# Altium schematic sheet MCU.SchDoc: Microcontroller
size B; CheckedBy: Lance Bantoto; Engineer: Cindy Li; Organization: Altium Limited; Address1: L3, 12a Rodborough Rd; Address2: Frenchs Forest; Address3: NSW; Address4: Australia 2086; Revision: 1; SheetNumber: 3; SheetTotal: 6
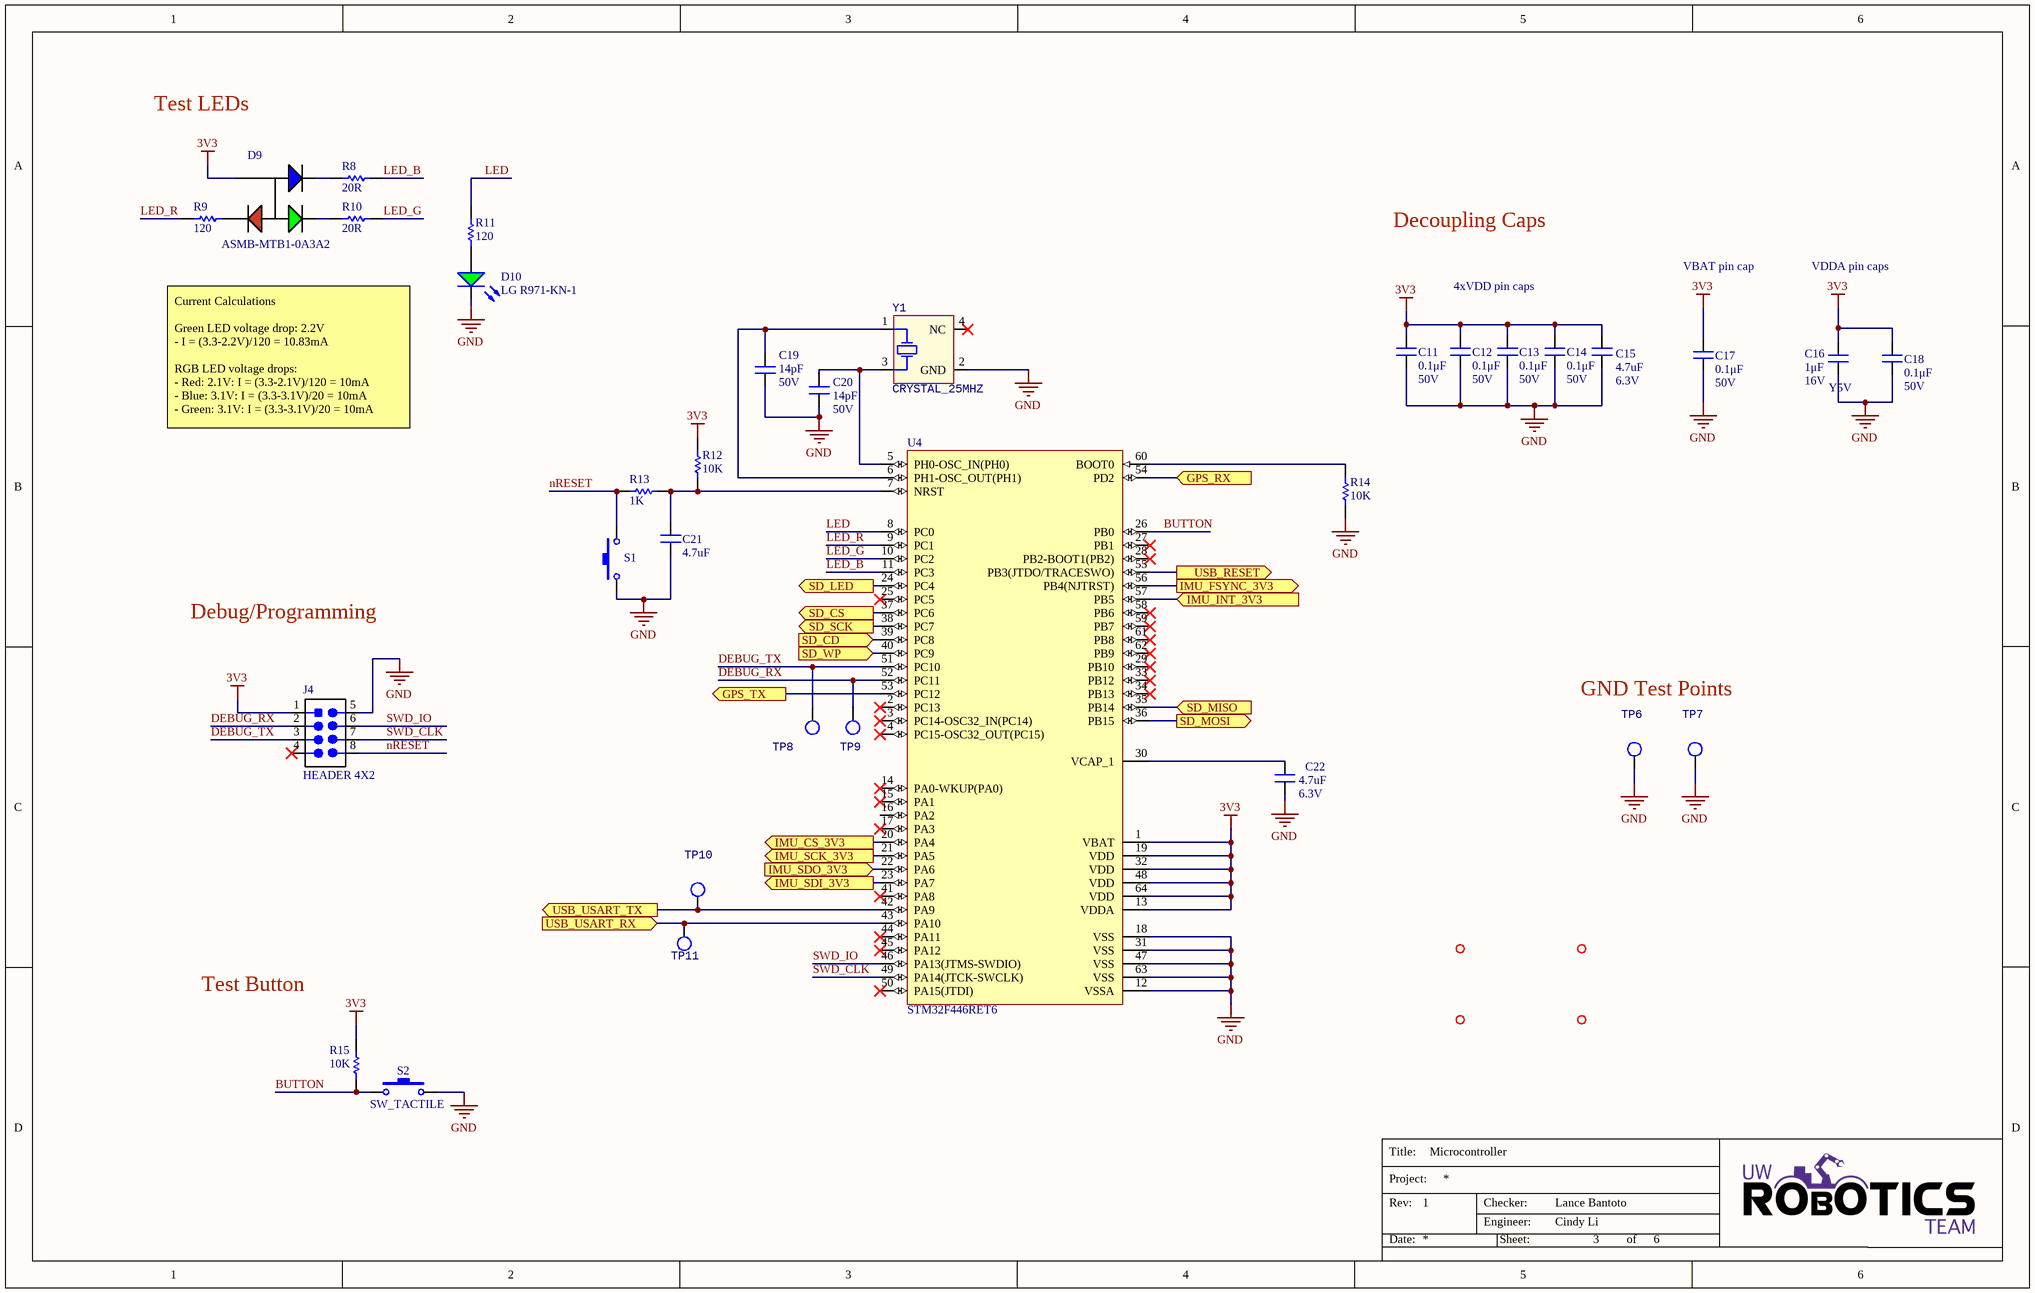
[diagram p0: MCU.SchDoc]

## Parts
C11  value 0.1μF  Voltage Rating: 50V  [CAP2012]  (hidden comment: CAP_0.1uF_50V_0805)
C12  value 0.1μF  Voltage Rating: 50V  [CAP2012]  (hidden comment: CAP_0.1uF_50V_0805)
C13  value 0.1μF  Voltage Rating: 50V  [CAP2012]  (hidden comment: CAP_0.1uF_50V_0805)
C14  value 0.1μF  Voltage Rating: 50V  [CAP2012]  (hidden comment: CAP_0.1uF_50V_0805)
C15  value 4.7uF  Voltage Rating: 6.3V  [CAPC0603(1608)55_N]  (hidden comment: CAP_4.7uF_0603)
C16  value 1μF  Voltage Rating: 16V  Dielectric: Y5V  [CAP0603]  (hidden comment: CAP_1uF_16V_0603)
C17  value 0.1μF  Voltage Rating: 50V  [CAP2012]  (hidden comment: CAP_0.1uF_50V_0805)
C18  value 0.1μF  Voltage Rating: 50V  [CAP2012]  (hidden comment: CAP_0.1uF_50V_0805)
C19  value 14pF  Voltage Rating (DC): 50V  [CAPC0603(1608)55_N]  (hidden comment: CL10C140JB8NNNC)
C20  value 14pF  Voltage Rating (DC): 50V  [CAPC0603(1608)55_N]  (hidden comment: CL10C140JB8NNNC)
C21  value 4.7uF  [CAPC0603(1608)55_N]  (hidden comment: CAP_4.7uF_0603)
C22  value 4.7uF  Voltage Rating: 6.3V  [CAPC0603(1608)55_N]  (hidden comment: CAP_4.7uF_0603)
D9  Manufacturer Part Number 1: ASMB-MTB1-0A3A2  [LED_RGB]  (hidden comment: LED_RGB)
D10  LG R971-KN-1  [LED_0805_GREEN]
J4  HEADER 4X2  [HEADER_2X4]
MH1  MOUNTING_HOLES  [MOUNTING_HOLE]  (value not drawn)
MH2  MOUNTING_HOLES  [MOUNTING_HOLE]  (value not drawn)
MH3  MOUNTING_HOLES  [MOUNTING_HOLE]  (value not drawn)
MH4  MOUNTING_HOLES  [MOUNTING_HOLE]  (value not drawn)
R8  value 20R  [RESC0603(1608)_N]  (hidden comment: RES_20R_0603)
R9  value 120  [RESC0603(1608)_N]  (hidden comment: RES_120R_0603)
R10  value 20R  [RESC0603(1608)_N]  (hidden comment: RES_20R_0603)
R11  value 120  [RESC0603(1608)_N]  (hidden comment: RES_120R_0603)
R12  value 10K  [RESC0603(1608)_N]  (hidden comment: RES_10K_0603)
R13  value 1K  [RESC0603(1608)_N]  (hidden comment: RES_1K_0603)
R14  value 10K  [RESC0603(1608)_N]  (hidden comment: RES_10K_0603)
R15  value 10K  [RESC0603(1608)_N]  (hidden comment: RES_10K_0603)
S1  SW_TACTILE  [B3U-1000P]  (value not drawn)
S2  SW_TACTILE  [B3U-1000P]
TP6  TESTPOINT_LOOP  [TESTPOINT_LOOP]  (value not drawn)
TP7  TESTPOINT_LOOP  [TESTPOINT_LOOP]  (value not drawn)
TP8  TESTPOINT_LOOP  [TESTPOINT_LOOP]  (value not drawn)
TP9  TESTPOINT_LOOP  [TESTPOINT_LOOP]  (value not drawn)
TP10  TESTPOINT_LOOP  [TESTPOINT_LOOP]  (value not drawn)
TP11  TESTPOINT_LOOP  [TESTPOINT_LOOP]  (value not drawn)
U4  STM32F446RET6  [STM-LQFP64_L]
Y1  CRYSTAL_25MHZ  [SOIC254P1016X440-4N]

## Ports
GPS_RX (in), GPS_TX (out), IMU_CS_3V3 (out), IMU_FSYNC_3V3 (out), IMU_INT_3V3 (in), IMU_SCK_3V3 (out), IMU_SDI_3V3 (out), IMU_SDO_3V3 (in), SD_CD (in), SD_CS (out), SD_LED (out), SD_MISO (in), SD_MOSI (out), SD_SCK (out), SD_WP (in), USB_RESET (out), USB_USART_RX (in), USB_USART_TX (out)

## Nets
3V3: C11.2 C12.2 C13.2 C14.2 C15.2 C16.2 C17.2 C18.2 D9.4(COMMON_ANODE) J4.1(VCC) R12.2 R15.1 U4.1(VBAT) U4.13(VDDA) U4.19(VDD) U4.32(VDD) U4.48(VDD) U4.64(VDD)
GND: C11.1 C12.1 C13.1 C14.1 C15.1 C16.1 C17.1 C18.1 C19.1 C20.1 C21.1 C22.1 D10.2(K) J4.5(GND) R14.2 S1.1 S2.2 TP6.1 TP7.1 U4.12(VSSA) U4.18(VSS) U4.31(VSS) U4.47(VSS) U4.63(VSS) Y1.2(GND)
BUTTON: R15.2 S2.1 U4.26(PB0)
DEBUG_RX: J4.2 TP9.1 U4.52(PC11)
DEBUG_TX: J4.3 TP8.1 U4.51(PC10)
GPS_RX: U4.54(PD2) ; port GPS_RX
GPS_TX: U4.53(PC12) ; port GPS_TX
IMU_CS_3V3: U4.20(PA4) ; port IMU_CS_3V3
IMU_FSYNC_3V3: U4.56(PB4(NJTRST)) ; port IMU_FSYNC_3V3
IMU_INT_3V3: U4.57(PB5) ; port IMU_INT_3V3
IMU_SCK_3V3: U4.21(PA5) ; port IMU_SCK_3V3
IMU_SDI_3V3: U4.23(PA7) ; port IMU_SDI_3V3
IMU_SDO_3V3: U4.22(PA6) ; port IMU_SDO_3V3
LED: R11.1 U4.8(PC0)
LED_B: R8.2 U4.11(PC3)
LED_G: R10.2 U4.10(PC2)
LED_R: R9.1 U4.9(PC1)
nRESET: J4.8 R13.1 S1.2
SD_CD: U4.39(PC8) ; port SD_CD
SD_CS: U4.37(PC6) ; port SD_CS
SD_LED: U4.24(PC4) ; port SD_LED
SD_MISO: U4.35(PB14) ; port SD_MISO
SD_MOSI: U4.36(PB15) ; port SD_MOSI
SD_SCK: U4.38(PC7) ; port SD_SCK
SD_WP: U4.40(PC9) ; port SD_WP
SWD_CLK: J4.7 U4.49(PA14(JTCK-SWCLK))
SWD_IO: J4.6 U4.46(PA13(JTMS-SWDIO))
USB_RESET: U4.55(PB3(JTDO/TRACESWO)) ; port USB_RESET
USB_USART_RX: TP11.1 U4.43(PA10) ; port USB_USART_RX
USB_USART_TX: TP10.1 U4.42(PA9) ; port USB_USART_TX
NetC19_2: C19.2 U4.6(PH1-OSC_OUT(PH1)) Y1.1(HOT)
NetC20_2: C20.2 U4.5(PH0-OSC_IN(PH0)) Y1.3(HOT)
NetC21_2: C21.2 R12.1 R13.2 U4.7(NRST)
NetC22_2: C22.2 U4.30(VCAP_1)
NetD9_1: D9.1(CATHODE_(RED)) R9.2
NetD9_2: D9.2(CATHODE_(GREEN)) R10.1
NetD9_3: D9.3(CATHODE_(BLUE)) R8.1
NetD10_1: D10.1(A) R11.2
NetR14_1: R14.1 U4.60(BOOT0)

Not connected (* = marked no-connect by the designer): J4 4*; U4 2(PC13)* 3(PC14-OSC32_IN(PC14))* 4(PC15-OSC32_OUT(PC15))* 14(PA0-WKUP(PA0))* 15(PA1)* 16(PA2) 17(PA3)* 25(PC5)* 27(PB1)* 28(PB2-BOOT1(PB2))* 29(PB10)* 33(PB12)* 34(PB13)* 41(PA8)* 44(PA11)* 45(PA12)* 50(PA15(JTDI))* 58(PB6)* 59(PB7)* 61(PB8)* 62(PB9)*; Y1 4(NC)*

## Notes on the sheet
- Test LEDs
- Decoupling Caps
- 4xVDD pin caps
- VBAT pin cap
- VDDA pin caps
- Current Calculations
  Green LED voltage drop: 2.2V
  - I = (3.3-2.2V)/120 = 10.83mA
  RGB LED voltage drops:
  - Red: 2.1V: I = (3.3-2.1V)/120 = 10mA
  - Blue: 3.1V: I = (3.3-3.1V)/20 = 10mA
  - Green: 3.1V: I = (3.3-3.1V)/20 = 10mA
- Debug/Programming
- GND Test Points
- Test Button
- Title:
- Project:
- Date:
- Rev:
- Checker:
- Engineer:
- Sheet:
- of

## Library data of the parts
C11-C14 C17 C18 = CAP_0.1uF_50V_0805: CAP CER 0.1UF 50V X7R 0805; Manufacturer 1: Murata Electronics; Manufacturer Part Number 1: GCD21BR71H104KA01L; Tolerance: 10%; Mount: Surface Mount; Case Code (Metric): 2012; Case Code (Imperial): 0805; Min Operating Temperature: -55°C; Max Operating Temperature: 125°C; Dielectric: X7R; Termination: SMD/SMT; Length: 2mm; Height: 1.25mm; Width: 0.049inch; Thickness: 0.049inch; Depth: 1.25mm; Ratings: AEC-Q200; Supplier 1: Digi-Key; Supplier Part Number 1: 490-11955-1-ND; Package: 0805 (2012 Metric)
C15 C21 C22 = CAP_4.7uF_0603: CAP CER 4.7UF 6.3V X5R 0603; Manufacturer Part Number 1: CC0603KRX5R5BB475; Manufacturer 1: Yageo; Dimensions: 0.063" L x 0.031" W (1.60mm x 0.80mm); Package: 0603 (1608 Metric); Temperature Coefficient: X5R; Supplier Part Number 1: 311-1521-1-ND; Supplier 1: Digi-Key; Mount: Surface Mount
  C21: Voltage Rating: 6.3V
C16 = CAP_1uF_16V_0603: CAP CER 1UF 16V Y5V 0603; Manufacturer 1: Yageo; Manufacturer Part Number: CC0603ZRY5V7BB105; Dimensions: 0.063" L x 0.031" W (1.60mm x 0.80mm); Package: 0603 (1608 Metric); Temperature Coefficient: Y5V; Supplier Part Number 1: 311-1372-1-ND; Supplier 1: Digi-Key; Mount: Surface Mount; Case Code (Imperial): 0603; Case Code (Metric): 1608; Manufacturer Part Number 1: CC0603ZRY5V7BB105
C19 C20 = CL10C140JB8NNNC: Cap Ceramic 14pF 50V C0G 5% SMD 0603 125C Cardboard T/R; Manufacturer 1: Samsung; Voltage Rating: 50V; Supplier Part Number 1: 1276-2187-1-ND; Supplier 1: Digi-Key; Manufacturer Part Number 1: CL10C140JB8NNNC; Stock 1: 187088; Pricing 1: 1=0.10000, 10=0.06700, 100=0.02980, 500=0.02130, 1000=0.01673 (USD); RoHS: Yes; Mount: Surface Mount; Case/Package: 0603; Case Code (Metric): 1608; Case Code (Imperial): 0603; Min Operating Temperature: -55°C; Max Operating Temperature: 125°C; Tolerance: 5%; Package Quantity: 1; Packaging: Tape and Reel; Dielectric: C0G; Length: 1.6mm; Height: 0.8mm; Width: 0.031inch; Depth: 0.8mm; Thickness: 0.035inch; Radiation Hardening: No; ComponentLink1URL: https://datasheet.ciiva.com/25782/cl10c140jb8nnnc-25782947.pdf?src-supplier=Digi-Key; ComponentLink1Description: https://datasheet.ciiva.com/25782/cl10c140jb8nnnc-25782947.pdf?src-supplier=Digi-Key; Capacitance: 14pF
D9 = LED_RGB: LED RGB DIFFUSED 4PLCC SMD; Manufacturer 1: Broadcom; Color: Blue,Green,Red; Lens Color: White; Viewing Angle: 115°; Lens Style: Round; Luminous Intensity: 350mcd; Dominant Wavelength: 470nm; Forward Voltage: 3.1V; Test Current: 20mA; Supplier 1: Digi-Key; Mount: Surface Mount; Case/Package: PLCC; Number of Pins: 4; Lens Transparency: Diffused; Length: 3.2mm; Height: 1.9mm; Width: 2.8mm; REACH SVHC: No SVHC; Supplier Part Number 1: 516-3280-1-ND
D10 = DIO_LED_G: LED GREEN DIFFUSED 0805 SMD; Manufacturer 1: OSRAM; Forward Voltage Drop: 2.2V; Package: 0805 (2012 Metric); Supplier Part Number 1: 475-1410-1-ND; Supplier 1: Digi-Key; Manufacturer Part Number 1: LG R971-KN-1; Mount: Surface Mount
J4 = HEADER 4X2: CONN HEADER VERT 8POS 2.54MM; Manufacturer Part Number 1: M20-9980445; Manufacturer 1: Harwin Inc.; Supplier Part Number 1: 952-2122-ND; Supplier 1: Digi-Key; Mount: Through Hole
MH1-MH4 = MOUNTING_HOLES: 6cm x 6cm
R8 R10 = RES_20R_0603: RES SMD 20 OHM 5% 1/10W 0603; Manufacturer 1: Yageo; Manufacturer Part Number 1: RC0603JR-0720RL; Package: 0603 (1608 Metric); Dimensions: 0.063" L x 0.031" W (1.60mm x 0.80mm); Tolerance: 5%; Supplier Part Number 1: 311-20GRCT-ND; Supplier 1: Digi-Key; Mount: Surface Mount
R9 R11 = RES_120R_0603: RES SMD 120 OHM 5% 1/10W 0603; Manufacturer 1: Yageo; Manufacturer Part Number 1: RC0603JR-07120RL; Package: 0603 (1608 Metric); Dimensions: 0.063" L x 0.031" W (1.60mm x 0.80mm); Tolerance: 5%; Supplier Part Number 1: 311-120GRCT-ND; Supplier 1: Digi-Key; Mount: Surface Mount
R12 R14 R15 = RES_10K_0603: RES SMD 10K OHM 5% 1/10W 0603; Manufacturer 1: Yageo; Manufacturer Part Number 1: RC0603JR-0710KL; Package: 0603 (1608 Metric); Dimensions: 0.063" L x 0.031" W (1.60mm x 0.80mm); Tolerance: 5%; Supplier Part Number 1: 311-10KGRCT-ND; Supplier 1: Digi-Key; Mount: Surface Mount
R13 = RES_1K_0603: RES SMD 1K OHM 5% 1/10W 0603; Manufacturer 1: Yageo; Manufacturer Part Number 1: RC0603JR-071KL; Dimensions: 0.063" L x 0.031" W (1.60mm x 0.80mm); Tolerance: 5%; Package: 0603 (1608 Metric); Supplier Part Number 1: 311-1.0KGRCT-ND; Supplier 1: Digi-Key; Mount: Surface Mount
S1 S2 = SW_TACTILE: Tactile Switch (Grey); Manufacturer 1: Omron Electronics Inc-EMC Div; Supplier Part Number 1: SW1020CT-ND; Supplier 1: Digi-Key; Manufacturer Part Number 1: B3U-1000P; Mount: Surface Mount
TP6-TP11 = TESTPOINT_LOOP: PC TEST POINT MINIATURE WHITE; Manufacturer Part Number 1: 5002; Manufacturer 1: Keystone Electronics; Supplier Part Number 1: 36-5002-ND; Supplier 1: Digi-Key; Mount: Through Hole
U4 = MCU_STM32F446RET6: ARM Cortex-M4 32-bit MCU+FPU, 512 KB Flash, 128 KB Internal RAM, 50 I/Os, 64-Pin LQFP, -40 to 85 degC, Tray; I/Os (High Current): 50; Supply Voltage(Vcc) min (V): 1.7; Operating Frequency(F) (Processor speed) (MHz): 180; D/A Converter: 2; Internal RAM Size (kB): 128; FLASH Size (Prog) (kB): 512; Core: ARM Cortex-M4; ComponentLink1Description: Manufacturer URL; Package Reference: 64-Pin Low-profile Quad Flat Package, Body 10 x 10 mm, Pitch 0.5 mm; ComponentLink2URL: http://www.st.com/st-web-ui/static/active/en/resource/technical/document/datasheet/DM00141306.pdf; Packing: Tray; DatasheetVersion: Rev. 6; ComponentLink1URL: http://www.st.com/; ComponentLink2Description: Datasheet; Package Description: LQFP64; Mounting Technology: Surface Mount; Supplier Part Number 1: 497-15376-ND; Supplier 1: Digi-Key
Y1 = CRYSTAL_25MHZ: CRYSTAL 25.0000MHZ 12PF SMD; Manufacturer 1: Kyocera AVX; Manufacturer Part Number 1: CX2520DB25000H0FLJC1; Frequency: 25MHz; ESR (Equivalent Series Resistance): 80R; Frequency Stability: 15ppm; Frequency Tolerance: 10ppm; Supplier 1: Digi-Key; Supplier Part Number 1: 1253-1724-1-ND; Mount: Surface Mount; Case/Package: SMD/SMT; Min Operating Temperature: -30°C; Max Operating Temperature: 85°C; Load Capacitance: 12pF; Length: 0.098inch; Height: 0.022inch; Width: 0.079inch; Ratings: AEC-Q200